# Altium project ProbeHead.PrjPcb
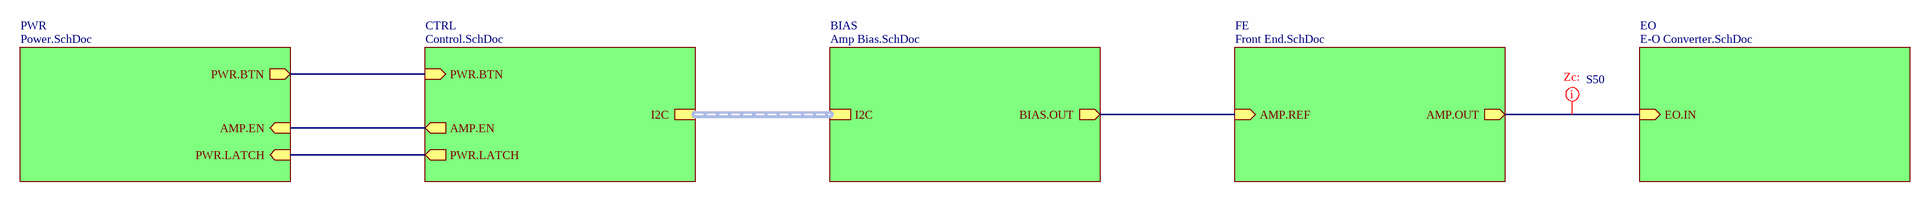
[diagram p0: Top.SchDoc]
Designer: Judd Foster
6 sheets, 107 parts. Net scope: hierarchical (ports join the sheet entries above them; power ports are global).
Board file: ProbeHead.PcbDoc
Sheets:
  Top.SchDoc
    PWR = Power.SchDoc
    CTRL = Control.SchDoc
    BIAS = Amp Bias.SchDoc
    FE = Front End.SchDoc
    EO = E-O Converter.SchDoc

## Sheet Top.SchDoc
size 406 x 304 mm; SheetNumber: 1; SheetTotal: 6

### Sub-sheets
BIAS = Amp Bias.SchDoc: BIAS.OUT (out), I2C (harness I2C)
CTRL = Control.SchDoc: PWR.BTN (in), PWR.LATCH (out), AMP.EN (out), I2C (harness I2C)
EO = E-O Converter.SchDoc: EO.IN (in)
FE = Front End.SchDoc: AMP.REF (in), AMP.OUT (out)
PWR = Power.SchDoc: PWR.BTN (out), PWR.LATCH (in), AMP.EN (in)

### Nets
AMP.EN: sheet PWR/AMP.EN, sheet CTRL/AMP.EN
AMP.REF: sheet BIAS/BIAS.OUT, sheet FE/AMP.REF
PWR.BTN: sheet PWR/PWR.BTN, sheet CTRL/PWR.BTN
PWR.LATCH: sheet PWR/PWR.LATCH, sheet CTRL/PWR.LATCH
NetU11_3: sheet FE/AMP.OUT, sheet EO/EO.IN

### Buses and harness runs
harness sheet BIAS/I2C = sheet CTRL/I2C

### Layout directives
net class S50: NetU11_3

### Notes on the sheet
- Sheet Name:
- Date:
- Sheet
- Designer:
- of

## Sheet Power.SchDoc
size 406 x 304 mm; SheetNumber: 2; SheetTotal: 6
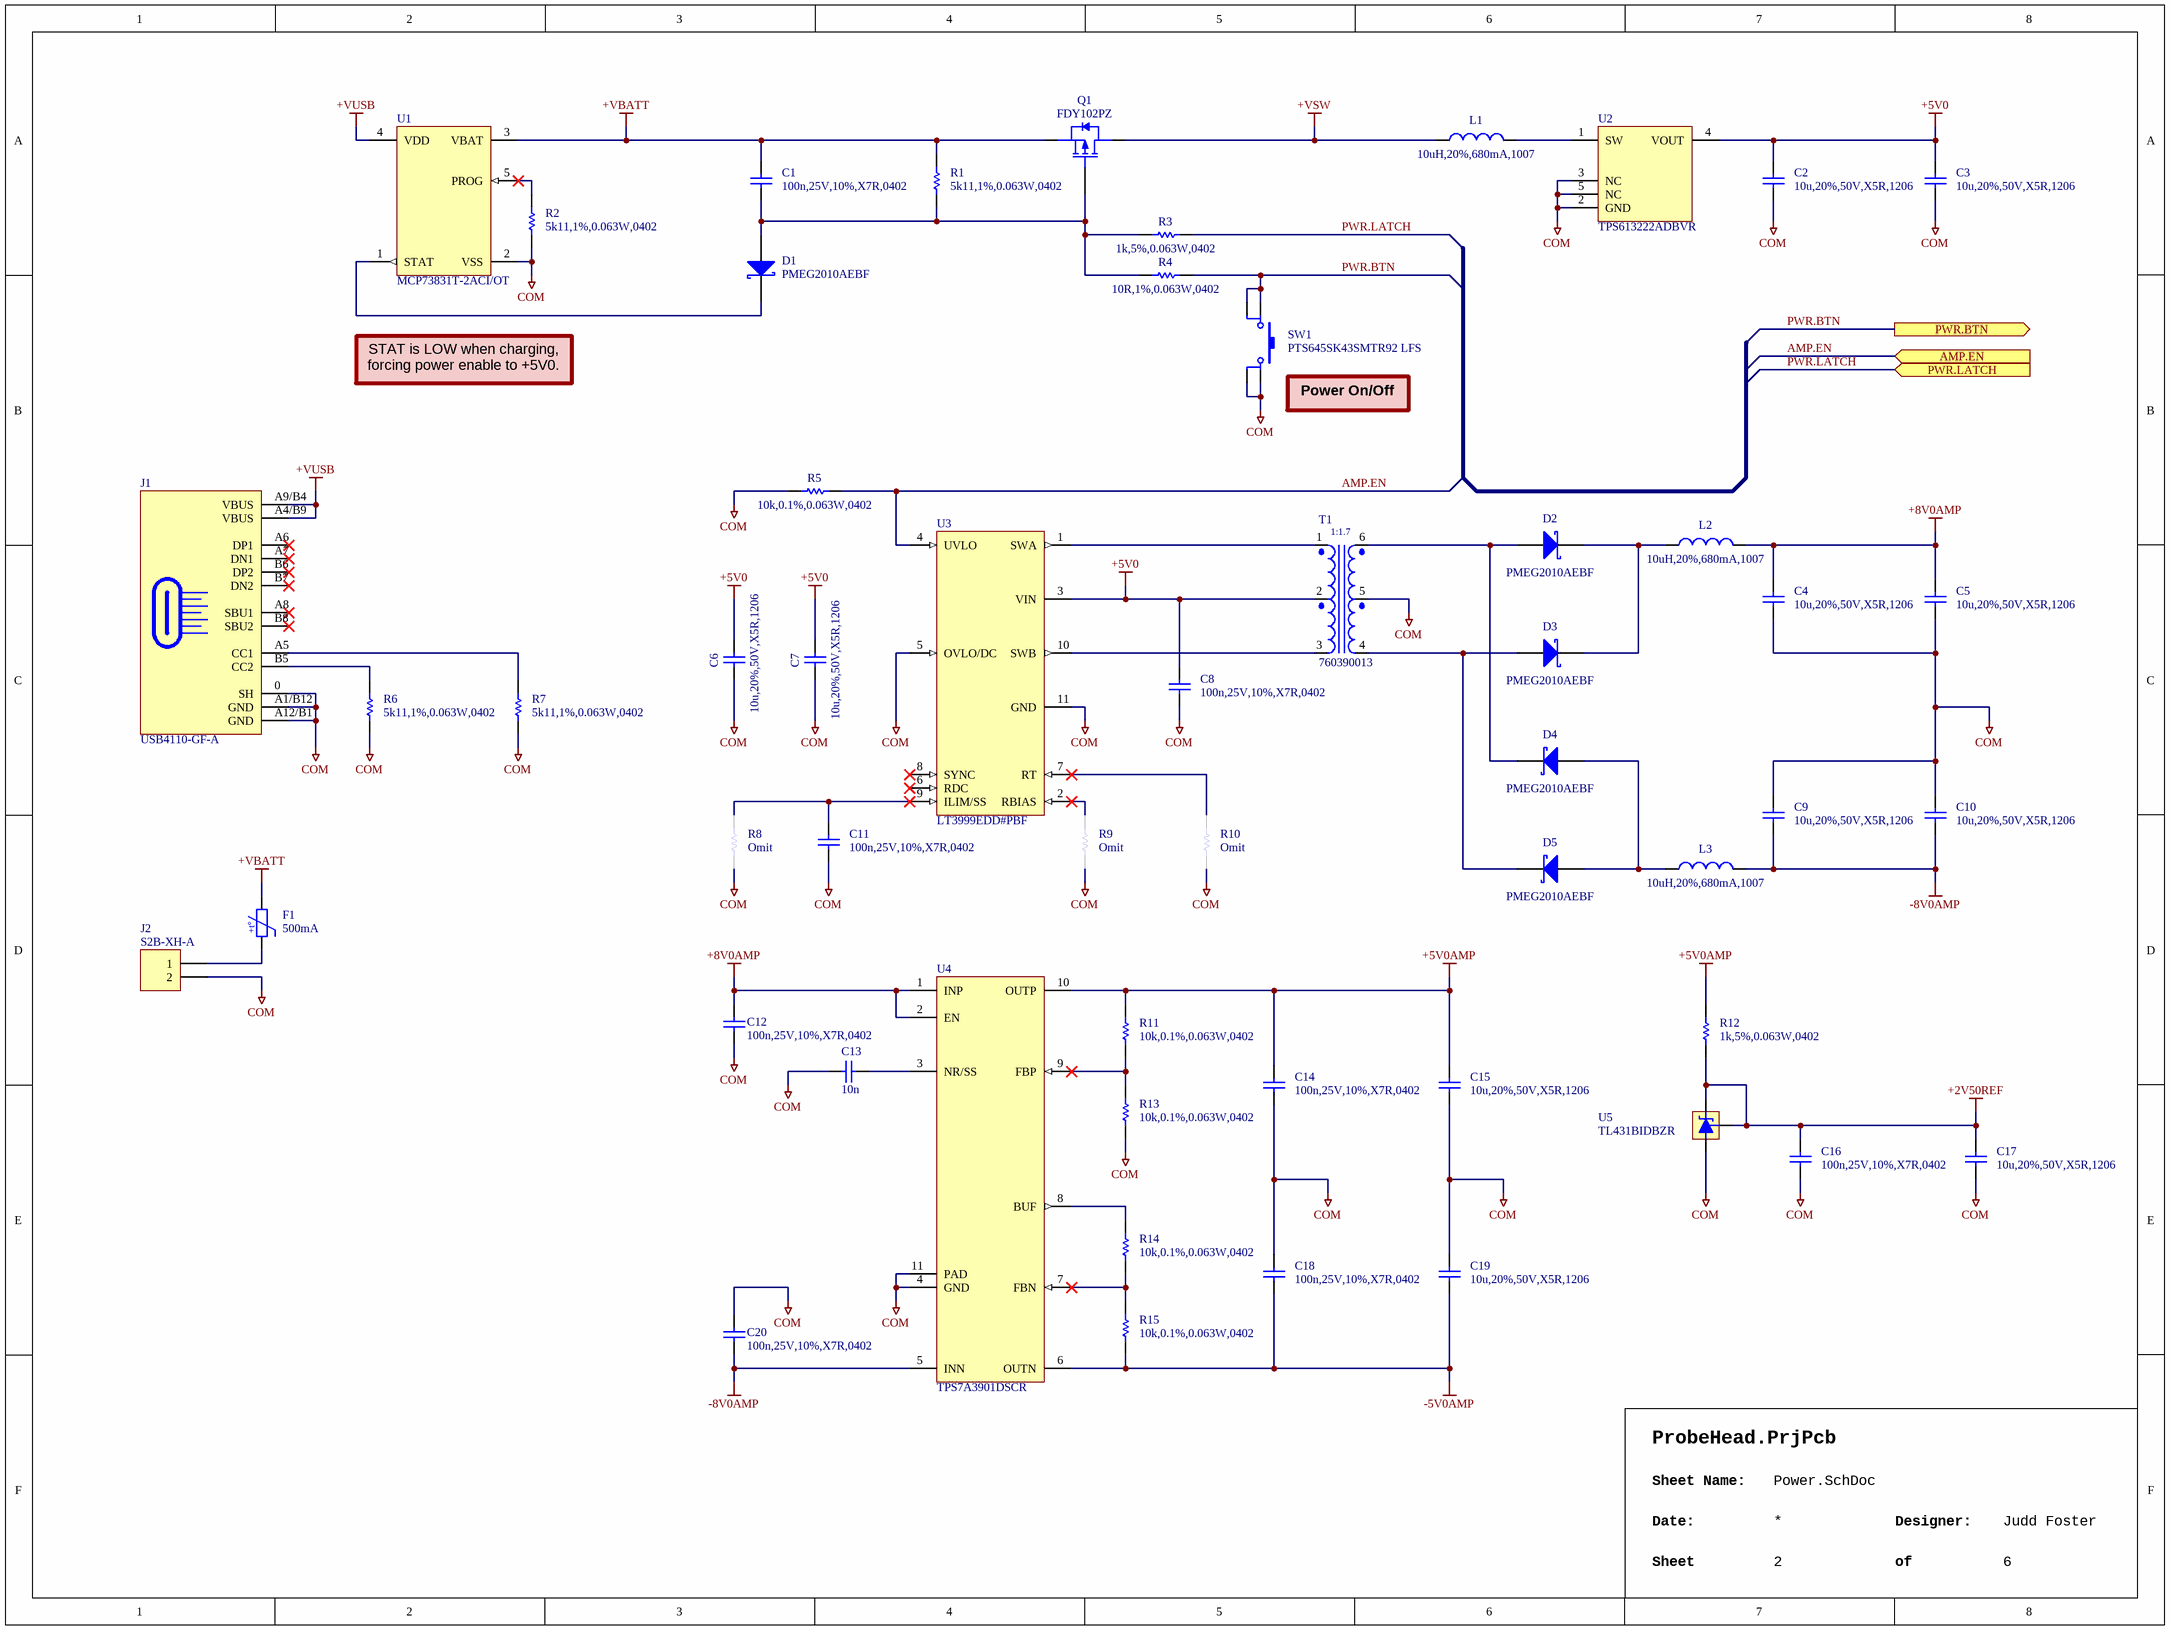
[diagram p1: Power.SchDoc]

### Parts
C1  100n,25V,10%,X7R,0402  [CAPC1005X06N]
C2  10u,20%,50V,X5R,1206  [CAPC3216X16N]
C3  10u,20%,50V,X5R,1206  [CAPC3216X16N]
C4  10u,20%,50V,X5R,1206  [CAPC3216X16N]
C5  10u,20%,50V,X5R,1206  [CAPC3216X16N]
C6  10u,20%,50V,X5R,1206  [CAPC3216X16N]
C7  10u,20%,50V,X5R,1206  [CAPC3216X16N]
C8  100n,25V,10%,X7R,0402  [CAPC1005X06N]
C9  10u,20%,50V,X5R,1206  [CAPC3216X16N]
C10  10u,20%,50V,X5R,1206  [CAPC3216X16N]
C11  100n,25V,10%,X7R,0402  [CAPC1005X06N]
C12  100n,25V,10%,X7R,0402  [CAPC1005X06N]
C13  10n  [CAPC1005X06N]
C14  100n,25V,10%,X7R,0402  [CAPC1005X06N]
C15  10u,20%,50V,X5R,1206  [CAPC3216X16N]
C16  100n,25V,10%,X7R,0402  [CAPC1005X06N]
C17  10u,20%,50V,X5R,1206  [CAPC3216X16N]
C18  100n,25V,10%,X7R,0402  [CAPC1005X06N]
C19  10u,20%,50V,X5R,1206  [CAPC3216X16N]
C20  100n,25V,10%,X7R,0402  [CAPC1005X06N]
D1  PMEG2010AEBF  [NEXPERIA_PKG_SOD523]
D2  PMEG2010AEBF  [NEXPERIA_PKG_SOD523]
D3  PMEG2010AEBF  [NEXPERIA_PKG_SOD523]
D4  PMEG2010AEBF  [NEXPERIA_PKG_SOD523]
D5  PMEG2010AEBF  [NEXPERIA_PKG_SOD523]
F1  500mA  [BELFUSE_CHIP1812]
J1  USB4110-GF-A  [GCT_USB4110-GF-A]
J2  S2B-XH-A  [JST_S2B-XH-A]
L1  10uH,20%,680mA,1007  [TAIYO-YUDEN_LSQPA251818T100M]
L2  10uH,20%,680mA,1007  [TAIYO-YUDEN_LSQPA251818T100M]
L3  10uH,20%,680mA,1007  [TAIYO-YUDEN_LSQPA251818T100M]
Q1  FDY102PZ  [ONSEMI_SC-89]
R1  5k11,1%,0.063W,0402  [RESC1005X04N]
R2  5k11,1%,0.063W,0402  [RESC1005X04N]
R3  1k,5%,0.063W,0402  [RESC1005X04N]
R4  10R,1%,0.063W,0402  [RESC1005X04N]
R5  10k,0.1%,0.063W,0402  [RESC1005X04N]
R6  5k11,1%,0.063W,0402  [RESC1005X04N]
R7  5k11,1%,0.063W,0402  [RESC1005X04N]
R8  Omit  [RESC1005X04N]  (no BOM)
R9  Omit  [RESC1005X04N]  (no BOM)
R10  Omit  [RESC1005X04N]  (no BOM)
R11  10k,0.1%,0.063W,0402  [RESC1005X04N]
R12  1k,5%,0.063W,0402  [RESC1005X04N]
R13  10k,0.1%,0.063W,0402  [RESC1005X04N]
R14  10k,0.1%,0.063W,0402  [RESC1005X04N]
R15  10k,0.1%,0.063W,0402  [RESC1005X04N]
SW1  PTS645SK43SMTR92 LFS  [C&K_PTS645SK43SMTR92 LFS]
T1  760390013  [WURTH_760390013]
U1  MCP73831T-2ACI/OT  [MICROCHIP_PKG_SOT23(C04-2091-OT)]
U2  TPS613222ADBVR  [TEXASINSTRUMENTS_PKG_DBV0005A]
U3  LT3999EDD#PBF  [ANALOGDEVICES_PKG_DD]
U4  TPS7A3901DSCR  [TEXASINSTRUMENTS_PKG_DSC0010J]
U5  TL431BIDBZR  [SOT95P240X120-3N]

### Ports
AMP.EN (in), PWR.BTN (out), PWR.LATCH (in)

### Nets
+2V50REF: C16.2 C17.2 R12.1 U5.1 U5.2
+5V0: C2.2 C3.2 C6.2 C7.2 C8.2 T1.2(PCT) U2.4(VOUT) U3.3(VIN)
+5V0AMP: C14.2 C15.2 R11.2 R12.2 U4.10(OUTP)
+8V0AMP: C4.2 C5.2 C12.2 L2.2 U4.1(INP) U4.2(EN)
+VBATT: C1.2 F1.2 Q1.2(S) R1.2 U1.3(VBAT)
+VSW: L1.1 Q1.3(D)
+VUSB: J1.A4/B9(VBUS) J1.A9/B4(VBUS) U1.4(VDD)
-5V0AMP: C18.1 C19.1 R15.1 U4.6(OUTN)
-8V0AMP: C9.1 C10.1 C20.1 L3.2 U4.5(INN)
COM: C2.1 C3.1 C4.1 C5.1 C6.1 C7.1 C8.1 C9.2 C10.2 C11.1 C12.1 C13.2 C14.1 C15.1 C16.1 C17.1 C18.2 C19.2 C20.2 J1.0(SH) J1.A1/B12(GND) J1.A12/B1(GND) J2.2 R2.1 R5.1 R6.1 R7.1 R8.1 R9.1 R10.1 R13.1 SW1.3 SW1.4 T1.5(SCT) U1.2(VSS) U2.2(GND) U2.3(NC) U2.5(NC) U3.5(OVLO/DC) U3.11(GND) U4.4(GND) U4.11(PAD) U5.3
AMP.EN: R5.2 U3.4(UVLO) ; port AMP.EN
PWR.BTN: R4.2 SW1.1 SW1.2 ; port PWR.BTN
PWR.LATCH: R3.1 ; port PWR.LATCH
NetC1_1: C1.1 D1.2(A) Q1.1(G) R1.1 R3.2 R4.1
NetC11_2: C11.2 R8.2 U3.9(ILIM/SS)
NetC13_1: C13.1 U4.3(NR/SS)
NetD1_1: D1.1(K) U1.1(STAT)
NetD2_1: D2.1(K) D3.1(K) L2.1
NetD2_2: D2.2(A) D4.1(K) T1.6(S+)
NetD3_2: D3.2(A) D5.1(K) T1.4(S-)
NetD4_2: D4.2(A) D5.2(A) L3.1
NetF1_1: F1.1 J2.1
NetJ1_A5: J1.A5(CC1) R7.2
NetJ1_B5: J1.B5(CC2) R6.2
NetL1_2: L1.2 U2.1(SW)
NetR2_2: R2.2 U1.5(PROG)
NetR9_2: R9.2 U3.2(RBIAS)
NetR10_2: R10.2 U3.7(RT)
NetR11_1: R11.1 R13.2 U4.9(FBP)
NetR14_1: R14.1 R15.2 U4.7(FBN)
NetR14_2: R14.2 U4.8(BUF)
NetT1_1: T1.1(P+) U3.1(SWA)
NetT1_3: T1.3(P-) U3.10(SWB)

Not connected (* = marked no-connect by the designer): J1 A6(DP1)* A7(DN1)* A8(SBU1)* B6(DP2)* B7(DN2)* B8(SBU2)*; U3 6(RDC)* 8(SYNC)*

### Notes on the sheet
- STAT is LOW when charging, forcing power enable to +5V0.
- (near SW1) Power On/Off
- Sheet Name:
- Date:
- Sheet
- Designer:
- of
- (in symbol PTC,30V,500mA,1812) +t°
- (in symbol XFR,1-1.7,Lp=475uH,760390013) 1:1.7

### Library data of the parts
C1 C8 C11 C12 C14 C16 C18 C20 = CAP,Cer,100nF,10%,25VDC,X7R,0402: 0.1ï¿½F ï¿½10% 25V Ceramic Capacitor X7R 0402 (1005 Metric); Manufacturer 1: Murata Electronics; Manufacturer 1 Part Number: GRM155R71E104KE14J; Vendor 1 Part Number: 490-14603-1-ND; Vendor 1: DigiKey; Value: 100nF; Part Name: CAP,Cer,100nF,10%,25VDC,X7R,0402; CreatedBy: Judd Foster; HelpURL: https://search.murata.co.jp/Ceramy/image/img/A01X/G101/ENG/GRM155R71E104KE14-01.pdf
C2-C7 C9 C10 C15 C17 C19 = CAP,Cer,10uF,50VDC,X5R,1206: 10ï¿½F ï¿½20% 50V Ceramic Capacitor X5R 1206 (3216 Metric); Manufacturer 1: Samsung Electro-Mechanics; Manufacturer 1 Part Number: CL31A106MBHNNNE; Vendor 1 Part Number: 1276-6736-1-ND; Vendor 1: Digikey; Part Name: CAP,Cer,10uF,50VDC,X5R,1206; CreatedBy: Judd Foster; HelpURL: https://www.samsungsem.com/resources/file/global/support/product_catalog/MLCC.pdf; Value: 10u
C13 = CAP,Cer,10nF,25VDC,X7R,0402: 10000pF ï¿½10% 25V Ceramic Capacitor X7R 0402 (1005 Metric); Manufacturer 1: Murata Electronics; Manufacturer 1 Part Number: GCM155R71E103KA37D; Vendor 1 Part Number: 490-6043-1-ND; Vendor 1: Digikey; Part Name: CAP,Cer,10nF,25VDC,X7R,0402; CreatedBy: Judd Foster; HelpURL: https://psearch.en.murata.com/capacitor/product/GCM155R71E103KA37%23.pdf; Value: 10n
D1-D5 = DIODE,Schottky,20V,1A,SOD523: Diode 20 V 1A Surface Mount SOD-523; Manufacturer 1: Nexperia USA Inc.; Vendor 1 Part Number: 1727-8539-1-ND; Vendor 1: DigiKey; Part Name: DIODE,Schottky,20V,1A,SOD523; CreatedBy: Judd Foster; HelpURL: https://assets.nexperia.com/documents/data-sheet/PMEG2010AEB.pdf; Manufacturer 1 Part Number: PMEG2010AEBF
F1 = PTC,30V,500mA,1812: Polymeric PTC Resettable Fuse 30V 500 mA Ih Surface Mount 1812 (4532 Metric), Concave; Manufacturer 1: Bel Fuse Inc.; Manufacturer 1 Part Number: 0ZCG0050AF2C; Vendor 1 Part Number: 507-1762-1-ND; Vendor 1: Digikey; Part Name: PTC,30V,500mA,1812; CreatedBy: Judd Foster; HelpURL: https://www.belfuse.com/resources/datasheets/circuitprotection/ds-cp-0zcg-series.pdf; Value: 500mA
J1 = Conn,USB_C,SMD: USB-C (USB TYPE-C) USB 2.0 Receptacle Connector 24 (16+8 Dummy) Position Surface Mount, Right Angle; Manufacturer 1: GCT; Vendor 1 Part Number: 2073-USB4110-GF-A-1-ND; Vendor 1: Digikey; Part Name: Conn,USB_C,SMD; CreatedBy: Judd Foster; HelpURL: https://gct.co/files/drawings/usb4110.pdf; Manufacturer 1 Part Number: USB4110-GF-A
J2 = Conn,JST,2Pin,2.5mm,RA,Thru: Connector Header Through Hole, Right Angle 2 position 0.098" (2.50mm); Manufacturer 1: JST Sales America Inc.; Vendor 1 Part Number: 455-S2B-XH-A-ND; Vendor 1: DigiKey; Part Name: Conn,JST,2Pin,2.5mm,RA,Thru; CreatedBy: Judd Foster; HelpURL: https://www.jst-mfg.com/product/pdf/eng/eXH.pdf; Manufacturer 1 Part Number: S2B-XH-A
L1-L3 = IND,10uH,680mA,Wirewound,1007: 10 ÂµH Unshielded Wirewound Inductor 680 mA 468mOhm Max 1007 (2518 Metric); Manufacturer 1: Taiyo Yuden; Manufacturer 1 Part Number: LSQPA251818T100M; Vendor 1 Part Number: 587-LSQPA251818T100MCT-ND; Vendor 1: Digikey; Part Name: IND,10uH,680mA,Wirewound,1007; CreatedBy: Judd Foster; HelpURL: https://mm.digikey.com/Volume0/opasdata/d220001/medias/docus/6025/LSQPA251818T100M_SS.pdf; Value: 10uH
Q1 = MOSFET,P Ch,20V,830mA: P-Channel 20 V 830mA (Ta) 625mW (Ta) Surface Mount SC-89-3; Manufacturer 1: onsemi; Vendor 1 Part Number: FDY102PZCT-ND; Vendor 1: Digikey; Part Name: MOSFET,P Ch,20V,830mA; CreatedBy: Judd Foster; HelpURL: https://rocelec.widen.net/view/pdf/hh954mlmw6/FAIR-S-A0000083184-1.pdf?t.download=true&u=5oefqw; Manufacturer 1 Part Number: FDY102PZ
R1 R2 R6 R7 = RES,5k11,1%,0.063W,0402: 5.11 kOhms ï¿½1% 0.063W, 1/16W Chip Resistor 0402 (1005 Metric) Automotive AEC-Q200, Moisture Resistant Thick Film; Manufacturer 1: Yageo; Manufacturer 1 Part Number: AC0402FR-075K11L; Vendor 1 Part Number: 13-AC0402FR-075K11LCT-ND; Vendor 1: Digikey; Part Name: RES,5k11,1%,0.063W,0402; CreatedBy: Judd Foster; HelpURL: https://www.yageo.com/upload/media/product/productsearch/datasheet/rchip/PYu-AC_51_RoHS_L_7.pdf; Value: 5k11
R3 R12 = RES,1k,5%,0.063W,0402: 1 kOhms ï¿½5% 0.063W, 1/16W Chip Resistor 0402 (1005 Metric) Automotive AEC-Q200 Thick Film; Manufacturer 1: Stackpole Electronics Inc; Manufacturer 1 Part Number: RMCF0402JT1K00; Vendor 1 Part Number: RMCF0402JT1K00CT-ND; Vendor 1: DIgikey; Part Name: RES,1k,5%,0.063W,0402; CreatedBy: Judd Foster; HelpURL: https://www.seielect.com/catalog/sei-rmcf_rmcp.pdf; Value: 1k
R4 = RES,10R,1%,0.063W,0402: 10 Ohms ï¿½1% 0.063W, 1/16W Chip Resistor 0402 (1005 Metric) Automotive AEC-Q200 Thick Film; Manufacturer 1: Panasonic Electronic Components; Manufacturer 1 Part Number: ERJ-2RKF10R0X; Vendor 1 Part Number: P10.0LCT-ND; Vendor 1: Digikey; Part Name: RES,10R,1%,0.063W,0402; CreatedBy: Judd Foster; HelpURL: https://industrial.panasonic.com/cdbs/www-data/pdf/RDA0000/AOA0000C304.pdf; Value: 10R
R5 R11 R13-R15 = RES,10k,0.1%,0.063W,0402: 10 kOhms ï¿½0.1% 0.1W, 1/10W Chip Resistor 0402 (1005 Metric) Automotive AEC-Q200 Thin Film; Manufacturer 1: Stackpole Electronics Inc; Manufacturer 1 Part Number: RNCF0402BTE10K0; Vendor 1 Part Number: RNCF0402BTE10K0CT-ND; Vendor 1: Digikey; Part Name: RES,10k,0.1%,0.063W,0402; CreatedBy: Judd Foster; HelpURL: https://www.seielect.com/catalog/sei-rncf.pdf; Value: 10k
R8-R10 = RES,Omit,0402: Part Name: RES,Omit,0402; CreatedBy: Judd Foster; HelpURL: N/A; Manufacturer 1: N/A; Manufacturer 1 Part Number: N/A; Vendor 1: N/A; Vendor 1 Part Number: N/A; Value: Omit
SW1 = Switch,Tactile,SPST-NO,SMD,H4.3: Tactile Switch SPST-NO Top Actuated Surface Mount; Manufacturer 1: C&K; Vendor 1 Part Number: CKN9084CT-ND; Vendor 1: Digikey; Part Name: Switch,Tactile,SPST-NO,SMD,H4.3; CreatedBy: Judd Foster; HelpURL: https://www.ckswitches.com/media/1471/pts645.pdf; Manufacturer 1 Part Number: PTS645SK43SMTR92 LFS
T1 = XFR,1-1.7,Lp=475uH,760390013: Forward, Push-Pull Converters For For DC/DC Converters SMPS Transformer 3125Vrms Isolation 10kHz Surface Mount; Manufacturer 1: WÃ¼rth Elektronik; Vendor 1 Part Number: 732-4457-1-ND; Vendor 1: DigiKey; Part Name: XFR,1-1.7,Lp=475uH,760390013; CreatedBy: Judd Foster; HelpURL: https://www.we-online.com/components/products/datasheet/760390013.pdf; Manufacturer 1 Part Number: 760390013
U1 = MCP73831T-2ACI_OT: Charger IC Lithium Ion/Polymer SOT-23-5; Manufacturer 1: Microchip Technology; Vendor 1 Part Number: MCP73831T-2ACI/OTCT-ND; Vendor 1: DigiKey; Part Name: MCP73831T-2ACI_OT; CreatedBy: Judd Foster; HelpURL: https://ww1.microchip.com/downloads/en/DeviceDoc/MCP73831-Family-Data-Sheet-DS20001984H.pdf; Manufacturer 1 Part Number: MCP73831T-2ACI/OT
U2 = TPS613222ADBVR: Boost Switching Regulator IC Positive Fixed 5V 1 Output 2.5A (Switch) SC-74A, SOT-753; Manufacturer 1: Texas Instruments; Vendor 1 Part Number: 296-50503-1-ND; Vendor 1: DigiKey; Part Name: TPS613222ADBVR; CreatedBy: Judd Foster; HelpURL: https://www.ti.com/lit/ds/symlink/tps61322.pdf?HQS=dis-dk-null-digikeymode-dsf-pf-null-wwe&ts=1737253084273; Manufacturer 1 Part Number: TPS613222ADBVR
U3 = LT3999EDD#PBF: Push-Pull Switching Regulator IC Positive, Isolation Capable Adjustable 1 Output 1A 10-WFDFN Exposed Pad; Manufacturer 1: Analog Devices Inc.; Vendor 1 Part Number: 505-LT3999EDD#PBF-ND; Vendor 1: DigiKey; Part Name: LT3999EDD#PBF; CreatedBy: Judd Foster; HelpURL: https://www.analog.com/media/en/technical-documentation/data-sheets/3999fa.pdf; Manufacturer 1 Part Number: LT3999EDD#PBF
U4 = TPS7A3901DSCR: Linear Voltage Regulator IC Positive and Negative Adjustable 2 Output 150mA 10-WSON (3x3); Manufacturer 1: Texas Instruments; Vendor 1 Part Number: 296-TPS7A3901DSCRCT-ND; Vendor 1: DigiKey; Part Name: TPS7A3901DSCR; CreatedBy: Judd Fosterr; HelpURL: https://www.ti.com/lit/ds/symlink/tps7a39.pdf?HQS=dis-dk-null-digikeymode-dsf-pf-null-wwe&ts=1737244835193&ref_url=https%253A%252F%252Fwww.ti.com%252Fgeneral%252Fdocs%252Fsuppproductinfo.tsp%253FdistId%253D10%2526gotoUrl%253Dhttps%253A%252F%252Fwww.ti.com; Manufacturer 1 Part Number: TPS7A3901DSCR
U5 = TL431BIDBZR: IC VREF SHUNT 36V 0.5% SOT23-3; Manufacturer 1: Texas Instruments; Vendor 1 Part Number: 296-18872-1-ND; Vendor 1: Digikey; Part Name: TL431BIDBZR; CreatedBy: Judd Foster; HelpURL: http://www.ti.com/lit/ds/symlink/tl431.pdf; Manufacturer 1 Part Number: TL431BIDBZR

## Sheet Control.SchDoc
size 406 x 304 mm; SheetNumber: 3; SheetTotal: 6
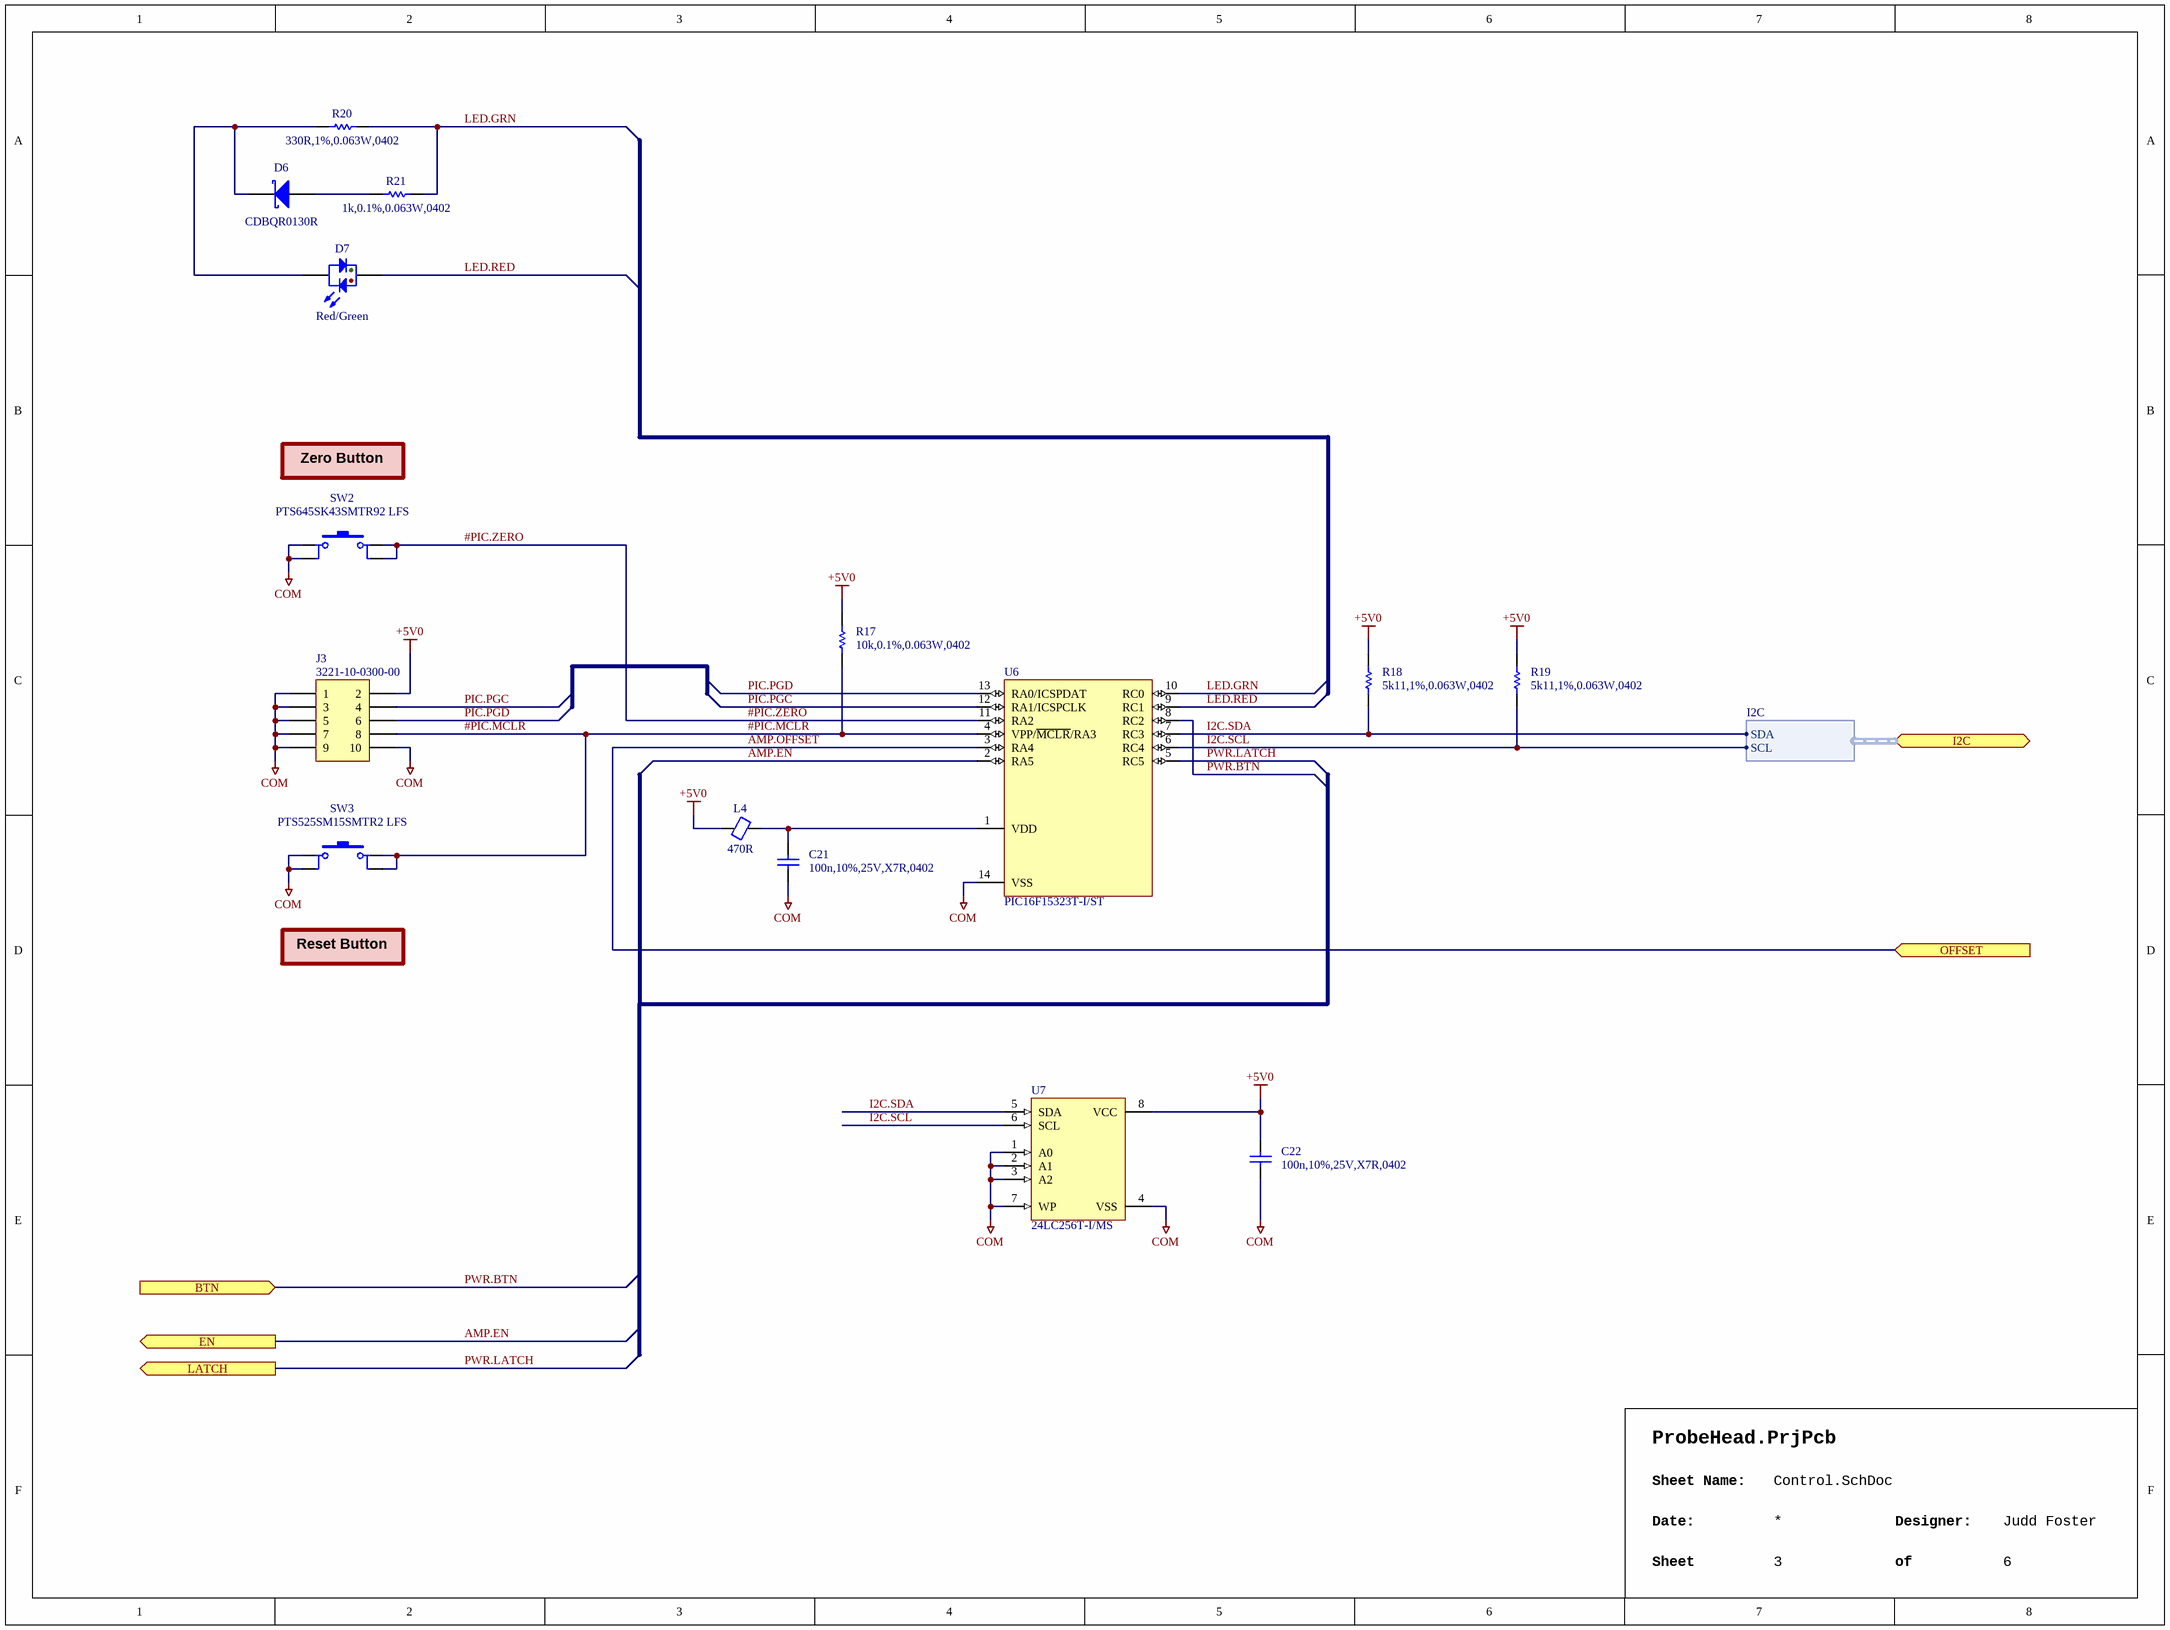
[diagram p2: Control.SchDoc]

### Parts
C21  100n,10%,25V,X7R,0402  [CAPC1005X06N]
C22  100n,10%,25V,X7R,0402  [CAPC1005X06N]
D6  CDBQR0130R  [DFN65P100X50-2N]
D7  Red/Green  [LED_XZMDKVG55W-4]
J3  3221-10-0300-00  [CNC Tech_3221-10-0300-00]
L4  470R  [INDC1005X05N]
R17  10k,0.1%,0.063W,0402  [RESC1005X04N]
R18  5k11,1%,0.063W,0402  [RESC1005X04N]
R19  5k11,1%,0.063W,0402  [RESC1005X04N]
R20  330R,1%,0.063W,0402  [RESC1005X04N]
R21  1k,0.1%,0.063W,0402  [RESC1005X04N]
SW2  PTS645SK43SMTR92 LFS  [C&K_PTS645SK43SMTR92 LFS]
SW3  PTS525SM15SMTR2 LFS  [C&K_PTS525SM15SMTR2 LFS]
U6  PIC16F15323T-I/ST  [MICROCHIP_PKG_TSSOP-14(C04-2087A)]
U7  24LC256T-I/MS  [MICROCHIP_PKG_MSOP8(C04-111-MS)]

### Ports
BTN (in), EN (out), I2C (bidir, harness I2C), LATCH (out), OFFSET (in)

### Harnesses
I2C: SCL, SDA

### Nets
+5V0: C22.2 J3.2 L4.1 R17.2 R18.2 R19.2 U7.8(VCC)
COM: C21.1 C22.1 J3.1 J3.3 J3.5 J3.7 J3.9 J3.10 SW2.1 SW2.2 SW3.1 SW3.2 U6.14(VSS) U7.1(A0) U7.2(A1) U7.3(A2) U7.4(VSS) U7.7(WP)
#PIC.MCLR: J3.8 R17.1 SW3.3 SW3.4 U6.4(VPP/~{MCLR}/RA3)
#PIC.ZERO: SW2.3 SW2.4 U6.11(RA2)
AMP.EN: U6.2(RA5) ; port EN
AMP.OFFSET: U6.3(RA4) ; port OFFSET
I2C.SCL: R19.1 U6.6(RC4) U7.6(SCL) ; port I2C.SCL
I2C.SDA: R18.1 U6.7(RC3) U7.5(SDA) ; port I2C.SDA
LED.GRN: R20.2 R21.2 U6.10(RC0)
LED.RED: D7.2(K) U6.9(RC1)
PIC.PGC: J3.4 U6.12(RA1/ICSPCLK)
PIC.PGD: J3.6 U6.13(RA0/ICSPDAT)
PWR.BTN: U6.8(RC2) ; port BTN
PWR.LATCH: U6.5(RC5) ; port LATCH
NetC21_2: C21.2 L4.2 U6.1(VDD)
NetD6_1: D6.1(K) D7.1(A) R20.1
NetD6_2: D6.2(A) R21.1

### Notes on the sheet
- Zero Button
- Reset Button
- Sheet Name:
- Date:
- Sheet
- Designer:
- of

### Library data of the parts
C21 C22 = CAP,Cer,100nF,10%,25V,X7R,0402: 0.1ï¿½F ï¿½10% 25V Ceramic Capacitor X7R 0402 (1005 Metric); Manufacturer 1: Murata Electronics; Manufacturer 1 Part Number: GRM155R71E104KE14J; Vendor 1 Part Number: 490-14603-1-ND; Vendor 1: DigiKey; Value: 100nF; Part Name: CAP,Cer,100nF,10%,25V,X7R,0402; CreatedBy: Judd Foster; HelpURL: https://search.murata.co.jp/Ceramy/image/img/A01X/G101/ENG/GRM155R71E104KE14-01.pdf
D6 = DIODE,Schottky,30V,100mA,SMD: Diode 30 V 100mA Surface Mount 0402C/SOD-923F; Manufacturer 1: Comchip Technology; Vendor 1 Part Number: 641-1272-1-ND; Vendor 1: Digikey; Part Name: DIODE,Schottky,30V,100mA,SMD; CreatedBy: Judd Foster; HelpURL: https://mm.digikey.com/Volume0/opasdata/d220001/medias/docus/3209/CDBQR0130R.pdf; Manufacturer 1 Part Number: CDBQR0130R
D7 = LED,Bi-Color,Red/Grn,SMD,1206: Green, Red 570nm Green, 630nm Red LED Indication - Discrete 2.1V Green, 1.95V Red 1206 (3216 Metric); Manufacturer 1: SunLED; Manufacturer 1 Part Number: XZMDKVG55W-4; Vendor 1 Part Number: 1497-1314-1-ND; Vendor 1: Digikey; Part Name: LED,Bi-Color,Red/Grn,SMD,1206; CreatedBy: Judd Foster; HelpURL: https://www.sunledusa.com/products/spec/XZMDKVG55W-4.pdf; Value: Red/Green
J3 = Term,Header,5x2 Pin,Shroud,1.27mm,SMD: Connector Header Surface Mount 10 position 0.050" (1.27mm); Manufacturer 1: CNC Tech; Vendor 1 Part Number: 1175-1735-ND; Vendor 1: Digikey; Part Name: Term,Header,5x2 Pin,Shroud,1.27mm,SMD; CreatedBy: Judd Foster; HelpURL: http://www.cnctech.us/pdfs/3221-XX-0300-00_.pdf; Manufacturer 1 Part Number: 3221-10-0300-00
L4 = Ferrite,470R@100MHz,0402: 470 Ohms @ 100 MHz 1 Power Line Ferrite Bead 0402 (1005 Metric) 1A 200mOhm; Manufacturer 1: Murata Electronics; Manufacturer 1 Part Number: BLM15PX471SN1D; Vendor 1 Part Number: 490-10662-1-ND; Vendor 1: Digikey; Part Name: Ferrite,470R@100MHz,0402; CreatedBy: Judd Foster; HelpURL: https://www.murata.com/en-us/products/productdata/8796740059166/ENFA0018.pdf; Value: 470R
R17 = RES,10k,0.1%,0.063W,0402: as R5 on sheet Power; Part Name: RES,10k,0.1%,0.063W,0402; CreatedBy: Judd Foster; HelpURL: https://www.seielect.com/catalog/sei-rncf.pdf; Value: 10k
R18 R19 = RES,5k11,1%,0.063W,0402: as R1 on sheet Power; Part Name: RES,5k11,1%,0.063W,0402; CreatedBy: Judd Foster; HelpURL: https://www.yageo.com/upload/media/product/productsearch/datasheet/rchip/PYu-AC_51_RoHS_L_7.pdf; Value: 5k11
R20 = RES,330R,1%,0.063W,0402: 330 Ohms Â±1% 0.063W, 1/16W Chip Resistor 0402 (1005 Metric) Moisture Resistant Thick Film; Manufacturer 1: YAGEO; Manufacturer 1 Part Number: RC0402FR-07330RL; Vendor 1 Part Number: 311-330LRCT-ND; Vendor 1: DigiKey; Part Name: RES,330R,1%,0.063W,0402; CreatedBy: Judd Foster; HelpURL: https://www.yageo.com/upload/media/product/products/datasheet/rchip/PYu-RC_Group_51_RoHS_L_12.pdf; Value: 330R
R21 = RES,1k,0.1%,0.063W,0402: 1 kOhms Â±0.1% 0.063W, 1/16W Chip Resistor 0402 (1005 Metric) Thin Film; Manufacturer 1: YAGEO; Manufacturer 1 Part Number: RT0402BRE071KL; Vendor 1 Part Number: YAG2306CT-ND; Vendor 1: DigiKey; Part Name: RES,1k,0.1%,0.063W,0402; CreatedBy: Judd Foster; HelpURL: https://www.yageo.com/upload/media/product/app/datasheet/rchip/pyu-rt_1-to-0.01_rohs_l.pdf; Value: 1k
SW2 = Switch,Tactile,SPST-NO,SMD,H4.3: as SW1 on sheet Power; Part Name: Switch,Tactile,SPST-NO,SMD,H4.3; CreatedBy: Judd Foster; HelpURL: https://www.ckswitches.com/media/1471/pts645.pdf; Manufacturer 1 Part Number: PTS645SK43SMTR92 LFS
SW3 = Switch,Tactile,SPST-NO,SMD,H1.5: Tactile Switch SPST-NO Top Actuated Surface Mount; Manufacturer 1: C&K; Vendor 1 Part Number: CKN9104CT-ND; Vendor 1: Digikey; Part Name: Switch,Tactile,SPST-NO,SMD,H1.5; CreatedBy: Judd Foster; HelpURL: https://www.ckswitches.com/media/1467/pts525.pdf; Manufacturer 1 Part Number: PTS525SM15SMTR2 LFS
U6 = PIC16F15323T-I_ST: PIC PICÂ® XLPâ„¢ 16F Microcontroller IC 8-Bit 32MHz 3.5KB (2K x 14) FLASH 14-TSSOP; Manufacturer 1: Microchip Technology; Vendor 1 Part Number: PIC16F15323T-I/STCT-ND; Vendor 1: DigiKey; Part Name: PIC16F15323T-I_ST; CreatedBy: Judd Foster; HelpURL: https://ww1.microchip.com/downloads/en/DeviceDoc/PIC16_L_F15313_23_Data_Sheet_40001897C.pdf; Manufacturer 1 Part Number: PIC16F15323T-I/ST
U7 = 24LC256T-I_MS: EEPROM Memory IC 256Kbit I2C 400 kHz 900 ns 8-MSOP; Manufacturer 1: Microchip Technology; Vendor 1 Part Number: 24LC256T-I/MSCT-ND; Vendor 1: DigiKey; Part Name: 24LC256T-I_MS; CreatedBy: Judd Foster; HelpURL: https://ww1.microchip.com/downloads/aemDocuments/documents/MPD/ProductDocuments/DataSheets/24AA256-24LC256-24FC256-256K-I2C-Serial-EEPROM-DS20001203.pdf; Manufacturer 1 Part Number: 24LC256T-I/MS

## Sheet Amp Bias.SchDoc
size 406 x 304 mm; SheetNumber: 4; SheetTotal: 6
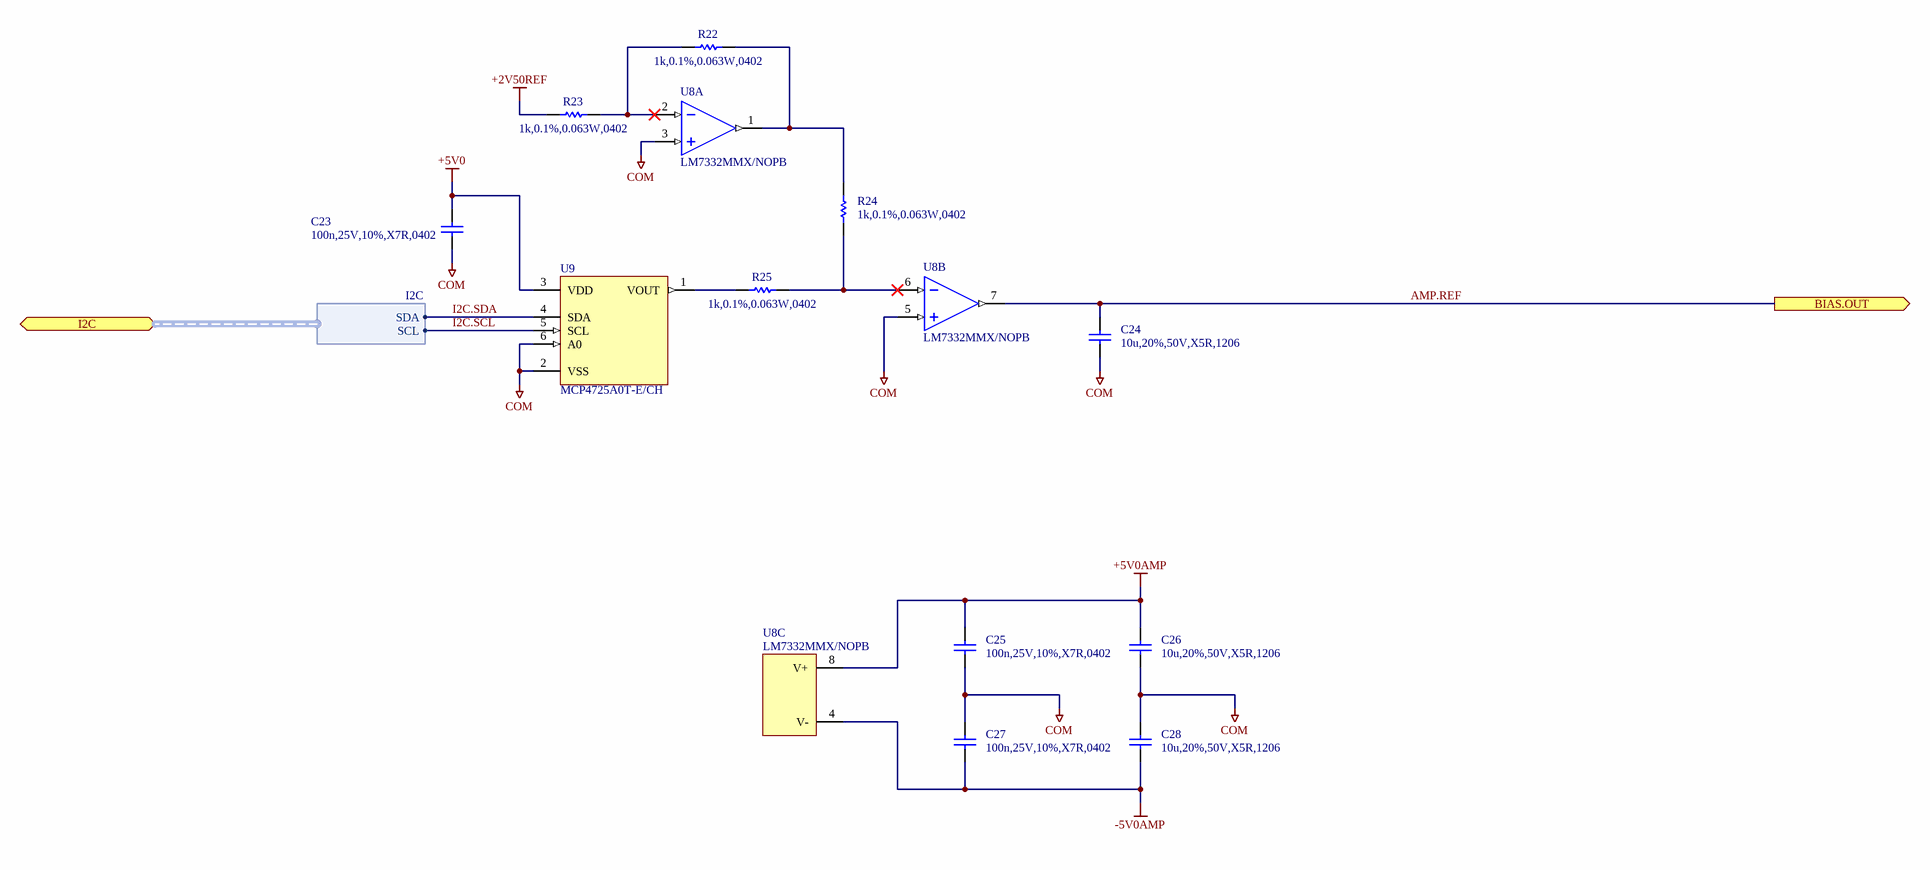
[diagram p3: Amp Bias.SchDoc]

### Parts
C23  100n,25V,10%,X7R,0402  [CAPC1005X06N]
C24  10u,20%,50V,X5R,1206  [CAPC3216X16N]
C25  100n,25V,10%,X7R,0402  [CAPC1005X06N]
C26  10u,20%,50V,X5R,1206  [CAPC3216X16N]
C27  100n,25V,10%,X7R,0402  [CAPC1005X06N]
C28  10u,20%,50V,X5R,1206  [CAPC3216X16N]
R22  1k,0.1%,0.063W,0402  [RESC1005X04N]
R23  1k,0.1%,0.063W,0402  [RESC1005X04N]
R24  1k,0.1%,0.063W,0402  [RESC1005X04N]
R25  1k,0.1%,0.063W,0402  [RESC1005X04N]
U8  LM7332MMX/NOPB  [TEXASINSTRUMENTS_PKG_DGK0008A]  (parts A,B,C of 3)
U9  MCP4725A0T-E/CH  [SOTFL95P260X145-6]

### Ports
BIAS.OUT (out), I2C (bidir, harness I2C)

### Harnesses
I2C: SCL, SDA

### Nets
+2V50REF: R23.1
+5V0: C23.2 U9.3(VDD)
+5V0AMP: C25.2 C26.2 U8.8(V+)
-5V0AMP: C27.1 C28.1 U8.4(V-)
COM: C23.1 C24.1 C25.1 C26.1 C27.2 C28.2 U8.3(INA+) U8.5(INB+) U9.2(VSS) U9.6(A0)
AMP.REF: C24.2 U8.7(OUTB) ; port BIAS.OUT
I2C.SCL: U9.5(SCL) ; port I2C.SCL
I2C.SDA: U9.4(SDA) ; port I2C.SDA
NetR22_1: R22.1 R23.2 U8.2(INA-)
NetR22_2: R22.2 R24.1 U8.1(OUTA)
NetR24_2: R24.2 R25.2 U8.6(INB-)
NetR25_1: R25.1 U9.1(VOUT)

### Notes on the sheet
- Sheet Name:
- Date:
- Sheet
- Designer:
- of

### Library data of the parts
C23 C25 C27 = CAP,Cer,100nF,10%,25VDC,X7R,0402: as C1 on sheet Power; Part Name: CAP,Cer,100nF,10%,25VDC,X7R,0402; CreatedBy: Judd Foster; HelpURL: https://search.murata.co.jp/Ceramy/image/img/A01X/G101/ENG/GRM155R71E104KE14-01.pdf
C24 C26 C28 = CAP,Cer,10uF,50VDC,X5R,1206: as C2 on sheet Power; Part Name: CAP,Cer,10uF,50VDC,X5R,1206; CreatedBy: Judd Foster; HelpURL: https://www.samsungsem.com/resources/file/global/support/product_catalog/MLCC.pdf; Value: 10u
R22-R25 = RES,1k,0.1%,0.063W,0402: as R21 on sheet Control; Part Name: RES,1k,0.1%,0.063W,0402; CreatedBy: Judd Foster; HelpURL: https://www.yageo.com/upload/media/product/app/datasheet/rchip/pyu-rt_1-to-0.01_rohs_l.pdf; Value: 1k
U8 = LM7332MMX_NOPB: General Purpose Amplifier 2 Circuit Rail-to-Rail 8-VSSOP; Manufacturer 1: Texas Instruments; Vendor 1 Part Number: 296-LM7332MMX/NOPBCT-ND; Vendor 1: DigiKey; Part Name: LM7332MMX_NOPB; CreatedBy: Judd Foster; HelpURL: https://www.ti.com/lit/ds/symlink/lm7332.pdf?HQS=dis-dk-null-digikeymode-dsf-pf-null-wwe&ts=1730932081789&ref_url=https%253A%252F%252Fwww.ti.com%252Fgeneral%252Fdocs%252Fsuppproductinfo.tsp%253FdistId%253D10%2526gotoUrl%253Dhttps%253A%252F%252Fwww.ti.com%; Manufacturer 1 Part Number: LM7332MMX/NOPB
U9 = MCP4725A0T-E/CH: 6us 12 I2C 2.7V~5.5V SOT-23-6 Digital To Analog Converters (DACs) ROHS; Manufacturer 1: Microchip; Vendor 1 Part Number: C144198; Vendor 1: LCSC; Part Name: MCP4725A0T-E/CH; CreatedBy: Judd Foster; HelpURL: https://datasheet.lcsc.com/lcsc/1811151442_Microchip-Tech-MCP4725A0T-E-CH_C144198.pdf; Manufacturer 1 Part Number: MCP4725A0T-E/CH

## Sheet Front End.SchDoc
size 406 x 304 mm; SheetNumber: 5; SheetTotal: 6
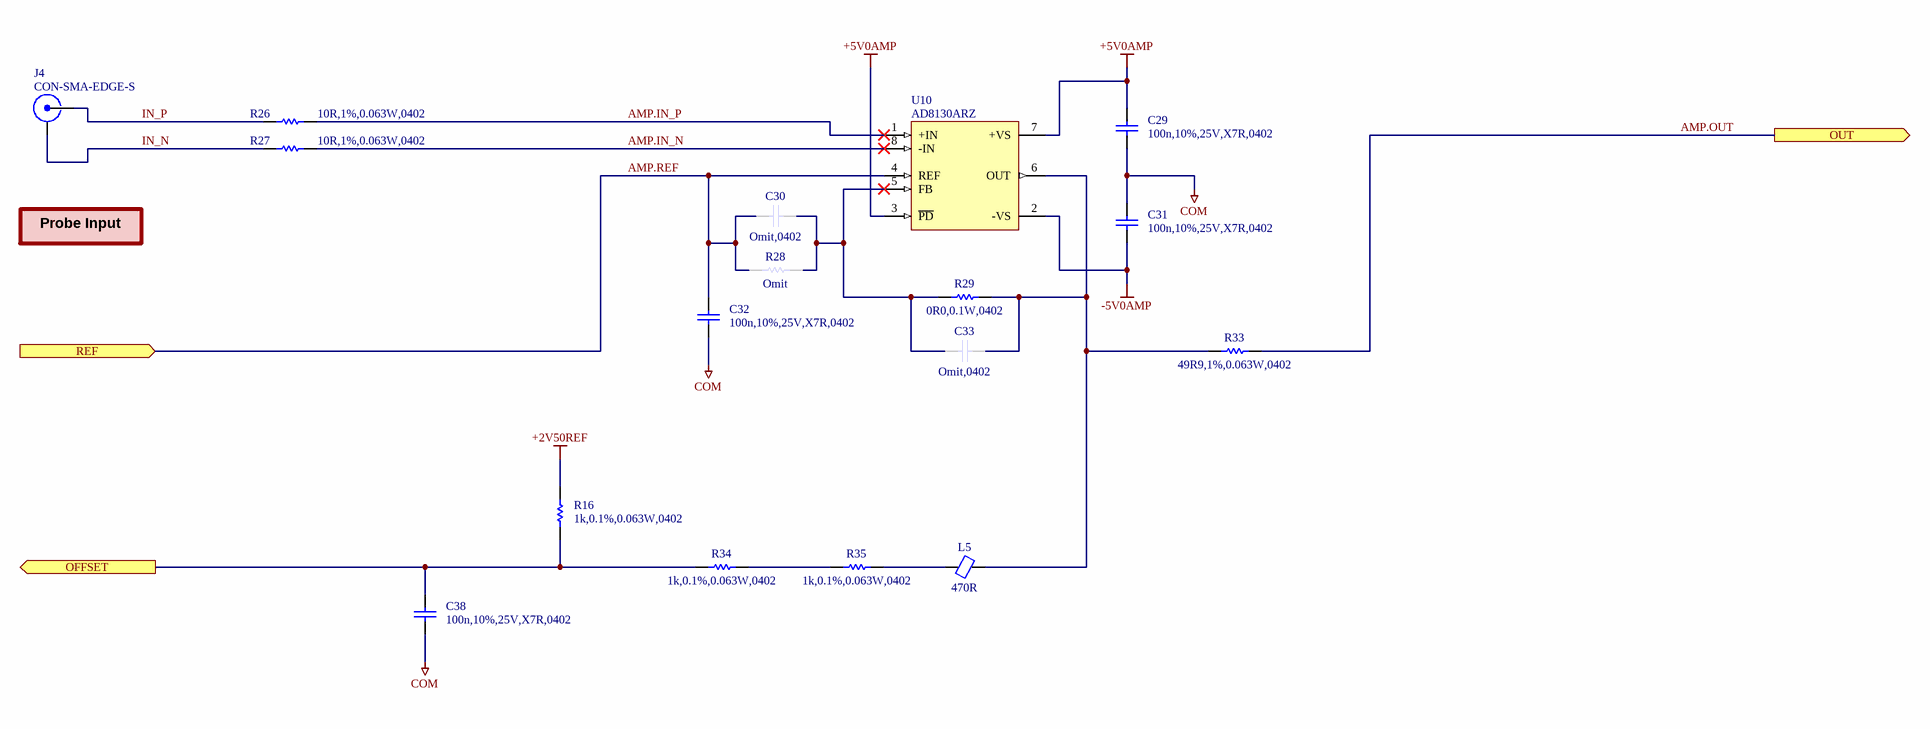
[diagram p4: Front End.SchDoc]

### Parts
C29  100n,10%,25V,X7R,0402  [CAPC1005X06N]
C30  Omit,0402  [CAPC1005X06N]  (no BOM)
C31  100n,10%,25V,X7R,0402  [CAPC1005X06N]
C32  100n,10%,25V,X7R,0402  [CAPC1005X06N]
C33  Omit,0402  [CAPC1005X06N]  (no BOM)
C38  100n,10%,25V,X7R,0402  [CAPC1005X06N]
J4  CON-SMA-EDGE-S  [RFSOLUTIONS_CON-SMA-EDGE-S]
L5  470R  [INDC1005X05N]
R16  1k,0.1%,0.063W,0402  [RESC1005X04N]
R26  10R,1%,0.063W,0402  [RESC1005X04N]
R27  10R,1%,0.063W,0402  [RESC1005X04N]
R28  Omit  [RESC1005X04N]  (no BOM)
R29  0R0,0.1W,0402  [RESC1005X04N]
R33  49R9,1%,0.063W,0402  [RESC1005X04N]
R34  1k,0.1%,0.063W,0402  [RESC1005X04N]
R35  1k,0.1%,0.063W,0402  [RESC1005X04N]
U10  AD8130ARZ  [ANALOGDEVICES_PKG_R-8]

### Ports
OFFSET (out), OUT (out), REF (in)

### Nets
+2V50REF: R16.2
+5V0AMP: C29.2 U10.3(~{PD}) U10.7(+VS)
-5V0AMP: C31.1 U10.2(-VS)
COM: C29.1 C31.2 C32.1 C38.1
AMP.IN_N: R27.2 U10.8(-IN)
AMP.IN_P: R26.2 U10.1(+IN)
AMP.OUT: R33.2 ; port OUT
AMP.REF: C30.1 C32.2 R28.1 U10.4(REF) ; port REF
IN_N: J4.2(GND) R27.1
IN_P: J4.1(RF) R26.1
NetC30_2: C30.2 C33.1 R28.2 R29.1 U10.5(FB)
NetC33_2: C33.2 L5.2 R29.2 R33.1 U10.6(OUT)
NetC38_2: C38.2 R16.1 R34.1 ; port OFFSET
NetL5_1: L5.1 R35.2
NetR34_2: R34.2 R35.1

### Notes on the sheet
- Probe Input
- Sheet Name:
- Date:
- Sheet
- Designer:
- of

### Library data of the parts
C29 C31 C32 C38 = CAP,Cer,100nF,10%,25V,X7R,0402: as C21 on sheet Control; Part Name: CAP,Cer,100nF,10%,25V,X7R,0402; CreatedBy: Judd Foster; HelpURL: https://search.murata.co.jp/Ceramy/image/img/A01X/G101/ENG/GRM155R71E104KE14-01.pdf
C30 C33 = CAP,Omit,0402: Omit; Part Name: CAP,Omit,0402; CreatedBy: Judd Foster; HelpURL: N/A; Manufacturer 1: N/A; Manufacturer 1 Part Number: N/A; Vendor 1: N/A; Vendor 1 Part Number: N/A; Value: Omit
J4 = Conn,RF,SMA,Fem,50R,Edge,SMD: SMA Connector Jack, Female Socket Board Edge, End Launch Solder; Manufacturer 1: RF Solutions; Vendor 1 Part Number: CON-SMA-EDGE-S-ND; Vendor 1: DigiKey; Part Name: Conn,RF,SMA,Fem,50R,Edge,SMD; CreatedBy: Judd Foster; HelpURL: https://www.rfsolutions.co.uk/content/download-files/CON-SMA-EDGE-6-DATASHEET.pdf; Manufacturer 1 Part Number: CON-SMA-EDGE-S
L5 = Ferrite,470R@100MHz,0402: as L4 on sheet Control; Part Name: Ferrite,470R@100MHz,0402; CreatedBy: Judd Foster; HelpURL: https://www.murata.com/en-us/products/productdata/8796740059166/ENFA0018.pdf; Value: 470R
R16 R34 R35 = RES,1k,0.1%,0.063W,0402: as R21 on sheet Control; Part Name: RES,1k,0.1%,0.063W,0402; CreatedBy: Judd Foster; HelpURL: https://www.yageo.com/upload/media/product/app/datasheet/rchip/pyu-rt_1-to-0.01_rohs_l.pdf; Value: 1k
R26 R27 = RES,10R,1%,0.063W,0402: as R4 on sheet Power; Part Name: RES,10R,1%,0.063W,0402; CreatedBy: Judd Foster; HelpURL: https://industrial.panasonic.com/cdbs/www-data/pdf/RDA0000/AOA0000C304.pdf; Value: 10R
R28 = RES,Omit,0402: Part Name: RES,Omit,0402; CreatedBy: Judd Foster; HelpURL: N/A; Manufacturer 1: N/A; Manufacturer 1 Part Number: N/A; Vendor 1: N/A; Vendor 1 Part Number: N/A; Value: Omit
R29 = RES,0R0,0.1W,0402: 0 Ohms Jumper 0.1W, 1/10W Chip Resistor 0402 (1005 Metric) Automotive AEC-Q200 Thick Film; Manufacturer 1: Panasonic Electronic Components; Manufacturer 1 Part Number: ERJ-2GE0R00X; Vendor 1 Part Number: P0.0JCT-ND; Vendor 1: Digikey; Value: 0R; Part Name: RES,0R0,0.1W,0402; CreatedBy: Judd Foster; HelpURL: https://industrial.panasonic.com/cdbs/www-data/pdf/RDA0000/AOA0000C301.pdf
R33 = RES,49R9,1%,0.063W,0402: 49.9 Ohms Â±1% 0.063W, 1/16W Chip Resistor 0402 (1005 Metric) Moisture Resistant Thick Film; Manufacturer 1: YAGEO; Manufacturer 1 Part Number: RC0402FR-0749R9L; Vendor 1 Part Number: 311-49.9LRCT-ND; Vendor 1: DigiKey; Part Name: RES,49R9,1%,0.063W,0402; CreatedBy: Judd Foster; HelpURL: https://www.yageo.com/upload/media/product/products/datasheet/rchip/PYu-RC_Group_51_RoHS_L_12.pdf; Value: 49R9
U10 = AD8130ARZ: Differential Amplifier 1 Circuit 8-SOIC; Manufacturer 1: Analog Devices; Vendor 1 Part Number: 505-AD8130ARZ-ND; Vendor 1: DigiKey; Part Name: AD8130ARZ; CreatedBy: Judd Foster; HelpURL: https://www.analog.com/media/en/technical-documentation/data-sheets/AD8129_8130.pdf; Manufacturer 1 Part Number: AD8130ARZ

## Sheet E-O Converter.SchDoc
size 406 x 304 mm; SheetNumber: 6; SheetTotal: 6
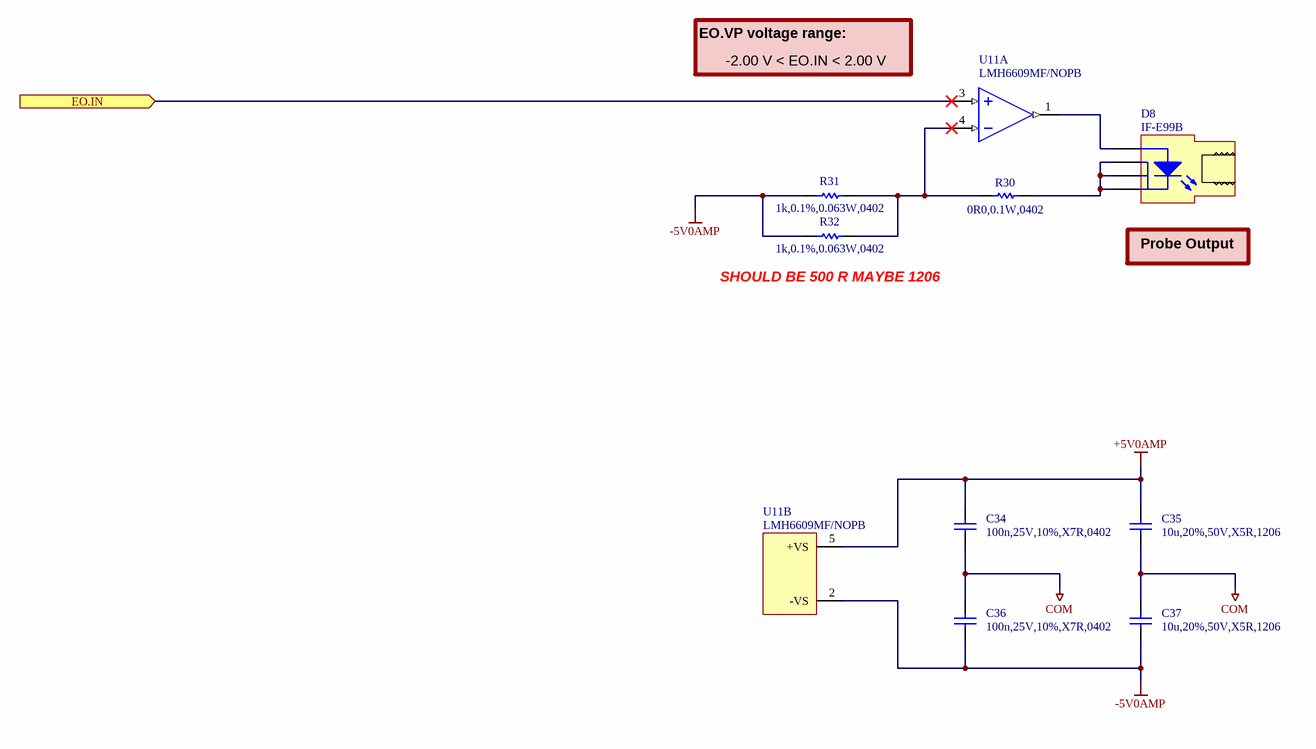
[diagram p5: E-O Converter.SchDoc]

### Parts
C34  100n,25V,10%,X7R,0402  [CAPC1005X06N]
C35  10u,20%,50V,X5R,1206  [CAPC3216X16N]
C36  100n,25V,10%,X7R,0402  [CAPC1005X06N]
C37  10u,20%,50V,X5R,1206  [CAPC3216X16N]
D8  IF-E99B  [INDUSTRIALFIBEROPTICS_IF-E99B]
R30  0R0,0.1W,0402  [RESC1005X04N]
R31  1k,0.1%,0.063W,0402  [RESC1005X04N]
R32  1k,0.1%,0.063W,0402  [RESC1005X04N]
U11  LMH6609MF/NOPB  [TEXASINSTRUMENTS_PKG_DBV0005A]  (parts A,B of 2)

### Ports
EO.IN (in)

### Nets
+5V0AMP: C34.2 C35.2 U11.5(+VS)
-5V0AMP: C36.1 C37.1 R31.1 R32.1 U11.2(-VS)
COM: C34.1 C35.1 C36.2 C37.2
NetD8_1: D8.1(K) D8.2(K) D8.4(K) R30.2
NetD8_3: D8.3(A) U11.1(OUT1)
NetR30_1: R30.1 R31.2 R32.2 U11.4(IN-)
NetU11_3: U11.3(IN+) ; port EO.IN

### Notes on the sheet
- -2.00 V < EO.IN < 2.00 V
- EO.VP voltage range:
- (near D8) Probe Output
- (near R32) SHOULD BE 500 R MAYBE 1206
- Sheet Name:
- Date:
- Sheet
- Designer:
- of

### Library data of the parts
C34 C36 = CAP,Cer,100nF,10%,25VDC,X7R,0402: as C1 on sheet Power; Part Name: CAP,Cer,100nF,10%,25VDC,X7R,0402; CreatedBy: Judd Foster; HelpURL: https://search.murata.co.jp/Ceramy/image/img/A01X/G101/ENG/GRM155R71E104KE14-01.pdf
C35 C37 = CAP,Cer,10uF,50VDC,X5R,1206: as C2 on sheet Power; Part Name: CAP,Cer,10uF,50VDC,X5R,1206; CreatedBy: Judd Foster; HelpURL: https://www.samsungsem.com/resources/file/global/support/product_catalog/MLCC.pdf; Value: 10u
D8 = XMITTER,FIBER OPTIC,650NM,1.9V,IF-E99B: Fiber Optic Transmitter 650nm 1.9V 50 mA Connector-less; Manufacturer 1: Industrial Fiber Optics; Vendor 1 Part Number: FB161-ND; Vendor 1: DigiKey; Part Name: XMITTER,FIBER OPTIC,650NM,1.9V,IF-E99B; CreatedBy: Judd Foster; HelpURL: https://i-fiberoptics.com/pdf/if-e99bdatasheet.pdf; Manufacturer 1 Part Number: IF-E99B
R30 = RES,0R0,0.1W,0402: as R29 on sheet Front End; Part Name: RES,0R0,0.1W,0402; CreatedBy: Judd Foster; HelpURL: https://industrial.panasonic.com/cdbs/www-data/pdf/RDA0000/AOA0000C301.pdf
R31 R32 = RES,1k,0.1%,0.063W,0402: as R21 on sheet Control; Part Name: RES,1k,0.1%,0.063W,0402; CreatedBy: Judd Foster; HelpURL: https://www.yageo.com/upload/media/product/app/datasheet/rchip/pyu-rt_1-to-0.01_rohs_l.pdf; Value: 1k
U11 = LMH6609MF_NOPB: Voltage Feedback Amplifier 1 Circuit SOT-23-5; Manufacturer 1: Texas Instruments; Vendor 1 Part Number: LMH6609MF/NOPBCT-ND; Vendor 1: DigiKey; Part Name: LMH6609MF_NOPB; CreatedBy: Judd Foster; HelpURL: https://www.ti.com/lit/ds/symlink/lmh6609.pdf; Manufacturer 1 Part Number: LMH6609MF/NOPB

## Nets that join several sheets
+2V50REF: Power (5 pins), Amp Bias (R23.1), Front End (R16.2)
+5V0: Power (8 pins), Control (7 pins), Amp Bias (C23.2 U9.3)
+5V0AMP: Power (5 pins), Amp Bias (C25.2 C26.2 U8.8), Front End (C29.2 U10.3 U10.7), E-O Converter (C34.2 C35.2 U11.5)
-5V0AMP: Power (C18.1 C19.1 R15.1 U4.6), Amp Bias (C27.1 C28.1 U8.4), Front End (C31.1 U10.2), E-O Converter (5 pins)
COM: Power (43 pins), Control (18 pins), Amp Bias (10 pins), Front End (C29.1 C31.2 C32.1 C38.1), E-O Converter (C34.1 C35.1 C36.2 C37.2)
I2C.SCL: Control (R19.1 U6.6 U7.6), Amp Bias (U9.5)
I2C.SDA: Control (R18.1 U6.7 U7.5), Amp Bias (U9.4)